# EAGLE design ComponentTester-rev.1 (EAGLE 9.5.1)
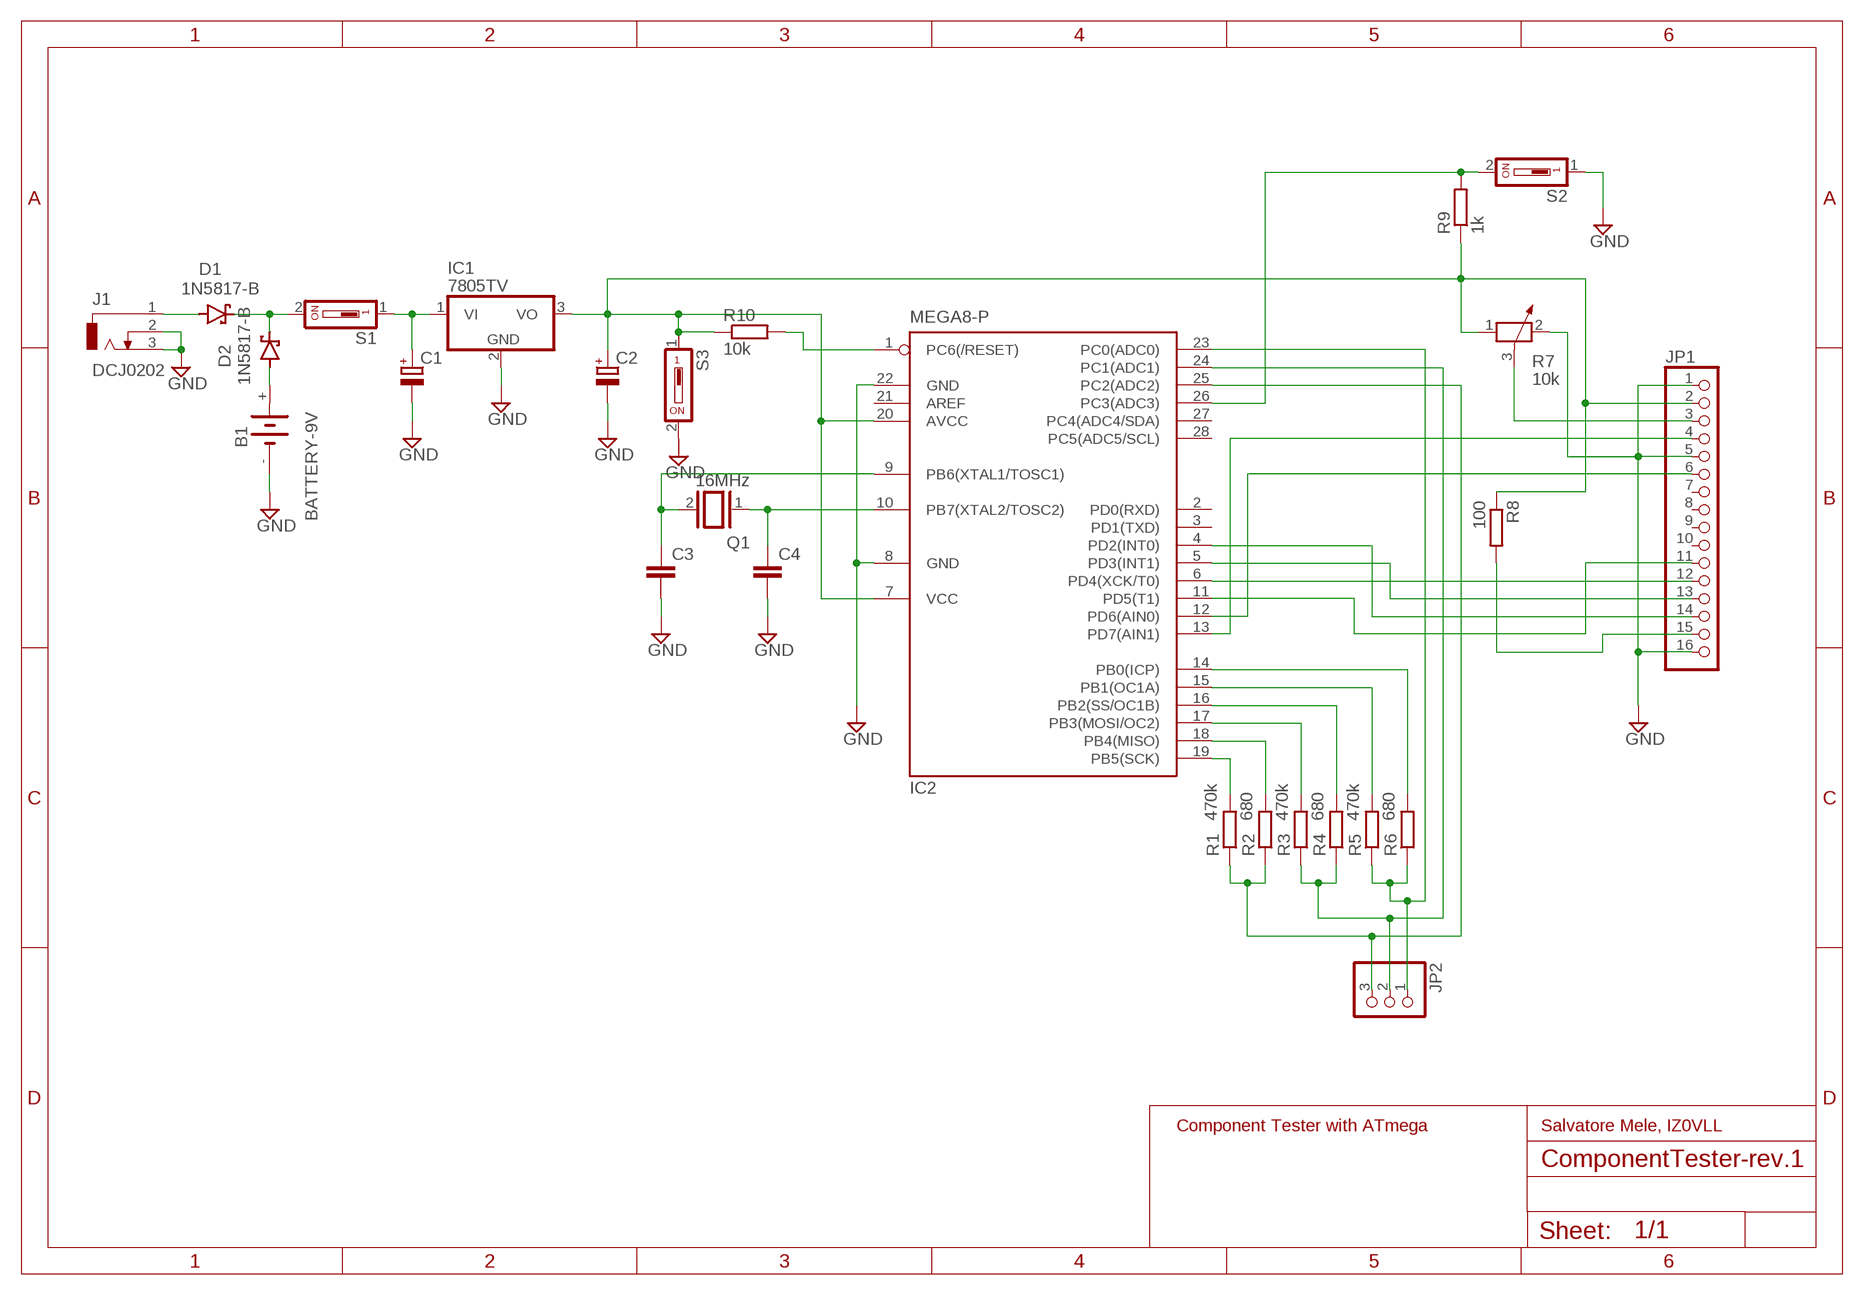
[diagram p0: schematic, sheet 1]

## Parts
B1  BATTERY-9V  [9V-BATTERY-SNAP]
C1  CPOL-EUE2.5-6  [E2,5-6]
C2  CPOL-EUE2.5-6  [E2,5-6]
C3  C-EU025-024X044  [C025-024X044]
C4  C-EU025-024X044  [C025-024X044]
D1  1N5817-B  [DO41-7.6]
D2  1N5817-B  [DO41-7.6]
IC1  7805TV  [TO220V]
IC2  MEGA8-P  [DIL28-3]
J1  DCJ0202  [DCJ0202]
JP1  PINHD-1X16  [1X16]
JP2  PINHD-1X3  [1X03]
Q1  16MHz  XTAL/S  [QS]
R1  470k  R-EU_0207/10  [0207/10]
R2  680  R-EU_0207/10  [0207/10]
R3  470k  R-EU_0207/10  [0207/10]
R4  680  R-EU_0207/10  [0207/10]
R5  470k  R-EU_0207/10  [0207/10]
R6  680  R-EU_0207/10  [0207/10]
R7  10k  POTENTIOMETER_PT-10S  [PT-10S]
R8  100  R-EU_0207/10  [0207/10]
R9  1k  R-EU_0207/10  [0207/10]
R10  10k  R-EU_0207/10  [0207/10]
S1  SD4-01  [SD4-01]
S2  SD4-01  [SD4-01]
S3  SD4-01  [SD4-01]

## Nets
GND: B1.- C1.- C2.- C3.2 C4.2 IC1.2(GND) IC2.8(GND) IC2.22(GND) J1.2 J1.3 JP1.1 JP1.5 JP1.16 R7.2 S2.1 S3.2
N$1: C1.+ IC1.1(VI) S1.1
N$2: C2.+ IC1.3(VO) IC2.7(VCC) IC2.20(AVCC) JP1.2 R7.1 R8.1 R9.1 R10.1 S3.1
N$3: IC2.14(PB0(ICP)) R6.2
N$4: IC2.15(PB1(OC1A)) R5.2
N$5: IC2.16(PB2(SS/OC1B)) R4.2
N$6: IC2.17(PB3(MOSI/OC2)) R3.2
N$7: IC2.18(PB4(MISO)) R2.2
N$8: IC2.19(PB5(SCK)) R1.2
N$9: IC2.25(PC2(ADC2)) JP2.3 R1.1 R2.1
N$10: IC2.24(PC1(ADC1)) JP2.2 R3.1 R4.1
N$11: IC2.23(PC0(ADC0)) JP2.1 R5.1 R6.1
N$12: JP1.3 R7.3
N$13: IC2.26(PC3(ADC3)) R9.2 S2.2
N$14: IC2.13(PD7(AIN1)) JP1.4
N$15: IC2.12(PD6(AIN0)) JP1.6
N$16: IC2.4(PD2(INT0)) JP1.14
N$17: IC2.5(PD3(INT1)) JP1.13
N$18: IC2.6(PD4(XCK/T0)) JP1.12
N$19: IC2.11(PD5(T1)) JP1.11
N$20: JP1.15 R8.2
N$21: C4.1 IC2.10(PB7(XTAL2/TOSC2)) Q1.1
N$22: C3.1 IC2.9(PB6(XTAL1/TOSC1)) Q1.2
N$23: IC2.1(PC6(/RESET)) R10.2
N$24: D1.A J1.1
N$25: B1.+ D2.A
N$26: D1.C D2.C S1.2
Unconnected: IC2.2(PD0(RXD)) IC2.3(PD1(TXD)) IC2.21(AREF) IC2.27(PC4(ADC4/SDA)) IC2.28(PC5(ADC5/SCL)) JP1.7 JP1.8 JP1.9 JP1.10

## Notes on the sheet
- Component Tester with ATmega | Salvatore Mele, IZ0VLL

## Library data of the parts
B1 = Power Jacks:BATTERY-9V: 9V battery
C1 C2 = rcl-smele:CPOL-EU: POLARIZED CAPACITOR, European symbol; SPICEPREFIX: C
C3 C4 = rcl-smele:C-EU: CAPACITOR, European symbol; SPICEPREFIX: C
D1 D2 = diode-IZ0VLL-1:1N581*: 1.0A SCHOTTKY BARRIER RECTIFIER Source: http://www.diodes.com/datasheets/ds23001.pdf
IC1 = linear:78*: Positive VOLTAGE REGULATOR Source: http://cache.national.com/ds/LM/LM78L05.pdf http://www.fairchildsemi.com/ds/LM/LM7805.pdf
IC2 = atmel:MEGA8-P: MICROCONTROLLER 8 Kbytes FLASH, 1 kbytes SRAM, 512 bytes EEPROM, USART, 4-channel 10 bit ADC, 2-channel 8 bit ADC Pin compatible with Atmega48, ATMega88, ATMega168 Source: avr.lbr; OC_FARNELL: unknown; OC_NEWARK: unknown
J1 = con-jack:DCJ0202: DC POWER JACK Source: DCJ0202.pdf; OC_FARNELL: unknown; OC_NEWARK: unknown
JP1 = pinhead:PINHD-1X16: PIN HEADER
JP2 = pinhead:PINHD-1X3: PIN HEADER
Q1 = special:XTAL/S: CRYSTAL
R1-R6 R8-R10 = rcl-smele:R-EU_: RESISTOR, European symbol; SPICEPREFIX: R
R7 = rcl-smele:POTENTIOMETER_: Potentiometer; SPICEMODEL: POT; SPICEPREFIX: X
S1-S3 = switch-dil:SD4-01: DIL/CODE SWITCH; OC_FARNELL: unknown; OC_NEWARK: unknown

## Board
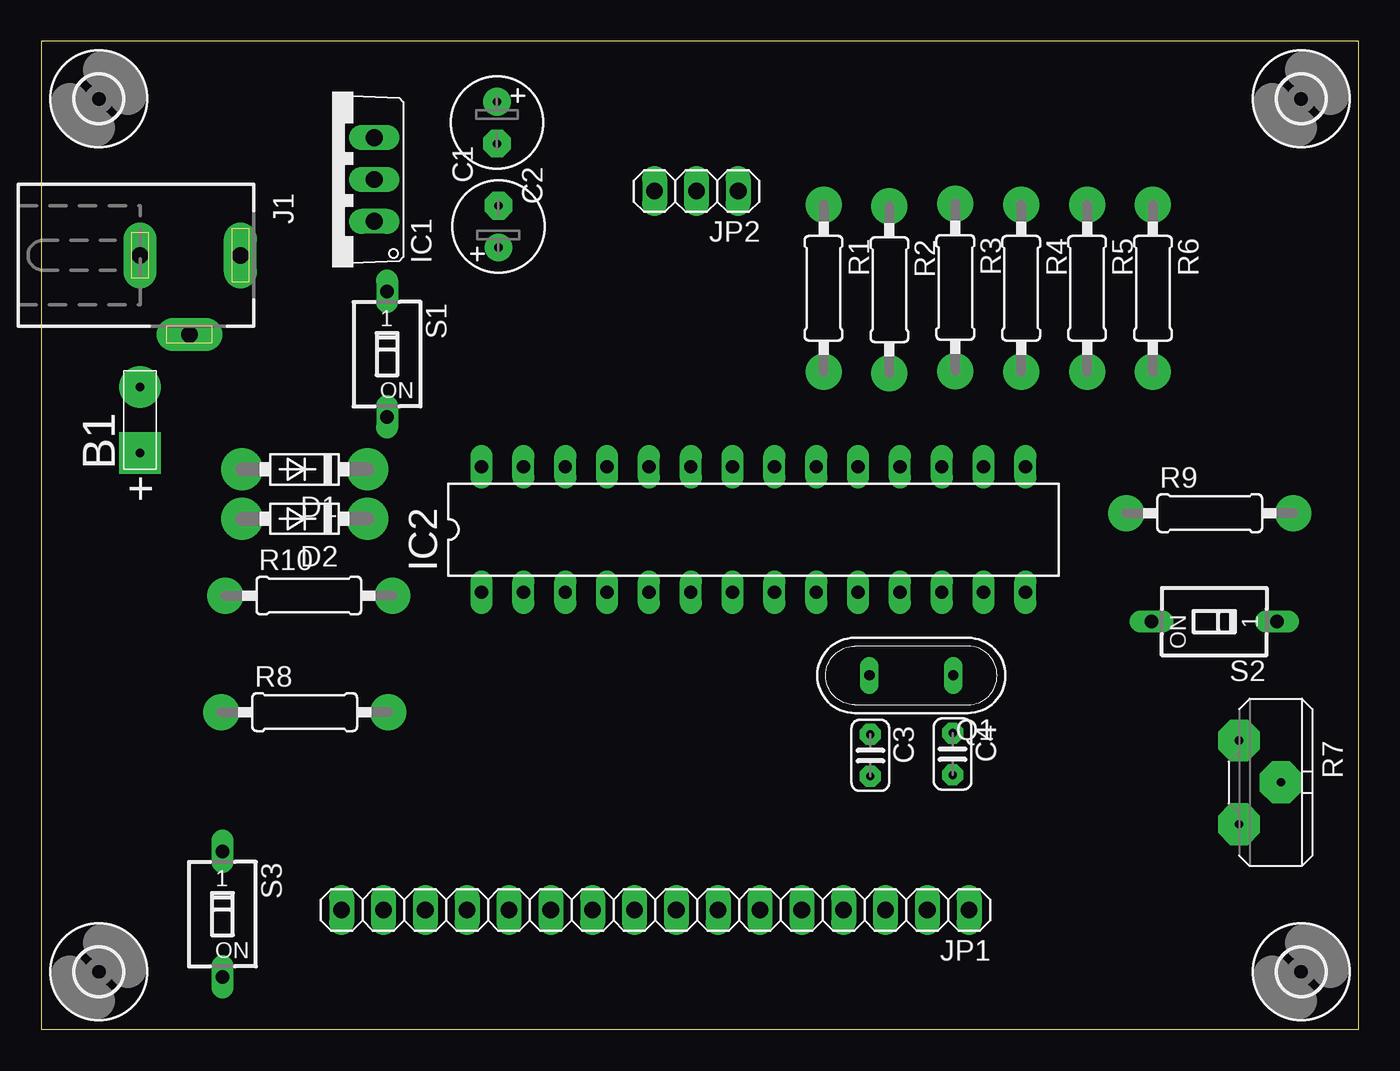
[diagram p1: board, top side]
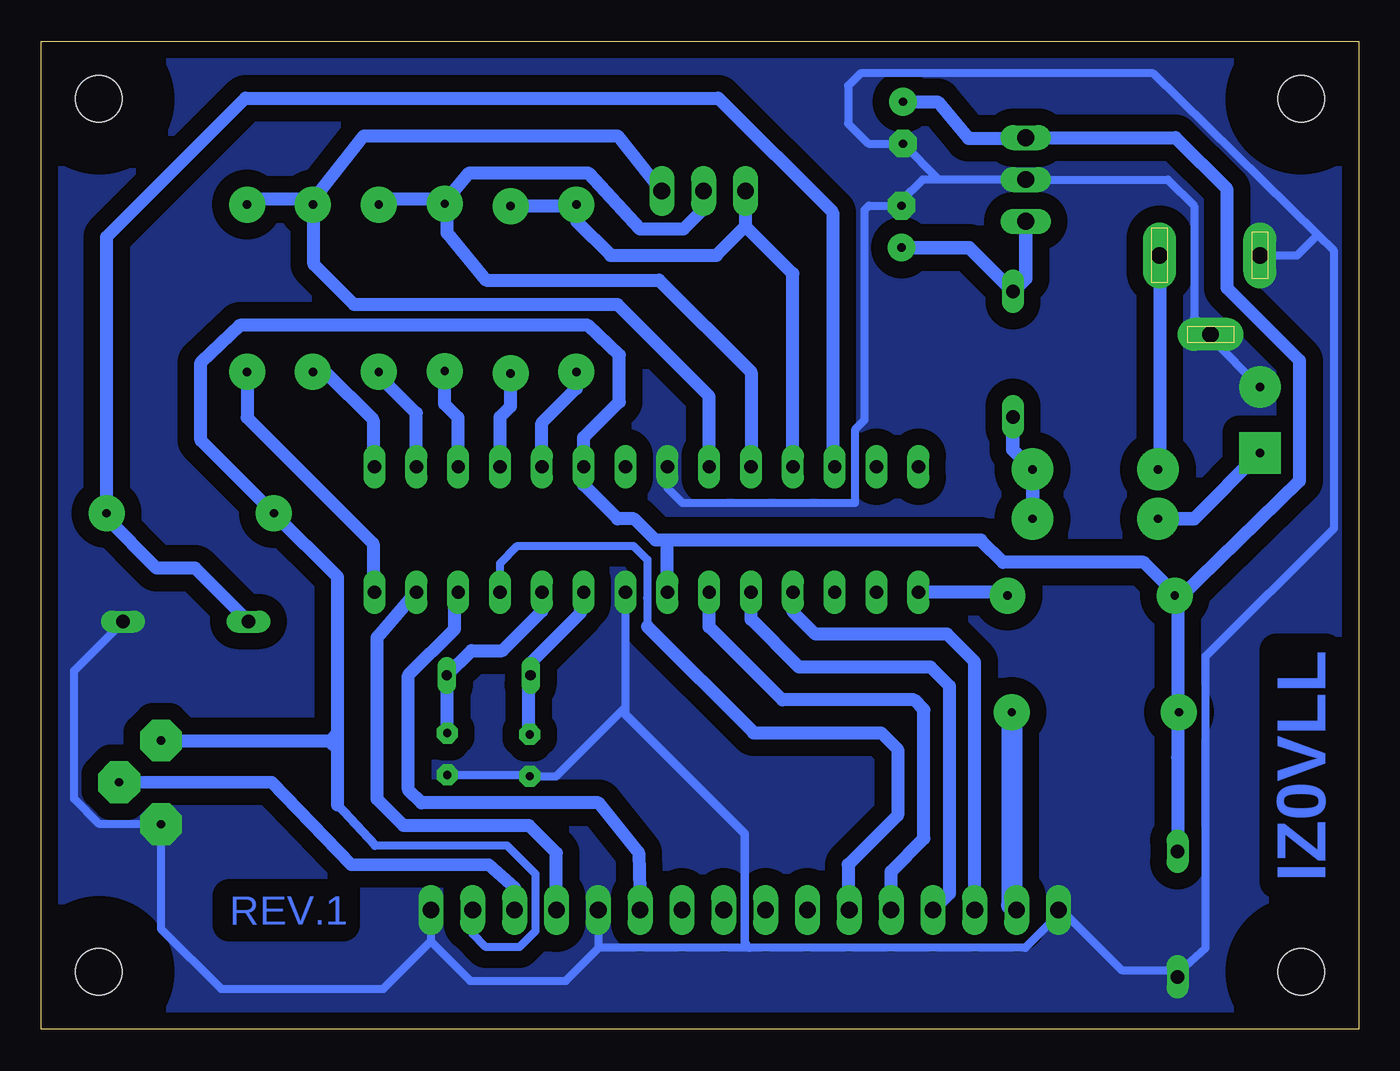
[diagram p2: board, bottom side, seen from below]

Size 80 x 60 mm. Coordinates in mm from the lower left corner, seen from the top.
Outline: 0,0 80,0 80,60 0,60 0,0
Copper layers (1*16): Top 0.035mm / dielectric 1.5mm / Bottom 0.035mm
Design rules "smele *": minimum track width 0.5mm, minimum drill 0.15mm, track to track 0.4mm, track to pad 0.25mm, pad to pad 0.25mm, via to via 0.25mm, smd to smd 6mil, copper to edge 0.5mm, drill to drill 0.25mm, minimum pad ring 10mil, minimum via ring 0.5mm, stop-mask expansion 4mil, vias tented up to drill 0mil, thermal gap 10mil

### Footprints (pad centres in the part's own frame; a part is rotated, then mirrored left to right if it is on the bottom)
9V-BATTERY-SNAP = drill 0.5 pad 2.54 square: + -2,0 | drill 0.5 pad 2.54: - 2,0
E2,5-6 = drill 0.5 pad 1.676: + -1.27,0 | drill 0.5 pad 1.676 octagon: - 1.27,0
C025-024X044 = drill 0.5 pad 1.27 octagon: 1 -1.27,0; 2 1.27,0
DO41-7.6 = drill 0.5 pad 2.54: A 3.81,0; C -3.81,0
TO220V = drill 1.016 long: 1 -2.54,-2.54; 2 0,-2.54; 3 2.54,-2.54
DIL28-3 = drill 0.813 long: 1 -16.51,-3.81; 2 -13.97,-3.81; 3 -11.43,-3.81; 4 -8.89,-3.81; 5 -6.35,-3.81; 6 -3.81,-3.81; 7 -1.27,-3.81; 8 1.27,-3.81; 9 3.81,-3.81; 10 6.35,-3.81; 11 8.89,-3.81; 12 11.43,-3.81; 13 13.97,-3.81; 14 16.51,-3.81; 15 16.51,3.81; 16 13.97,3.81; 17 11.43,3.81; 18 8.89,3.81; 19 6.35,3.81; 20 3.81,3.81; 21 1.27,3.81; 22 -1.27,3.81; 23 -3.81,3.81; 24 -6.35,3.81; 25 -8.89,3.81; 26 -11.43,3.81; 27 -13.97,3.81; 28 -16.51,3.81
DCJ0202 = drill 1 pad 2 long: 1 0,3.1; 2 4.8,0; 3 0,-3
1X16 = drill 1.016 long: 1 -19.05,0; 2 -16.51,0; 3 -13.97,0; 4 -11.43,0; 5 -8.89,0; 6 -6.35,0; 7 -3.81,0; 8 -1.27,0; 9 1.27,0; 10 3.81,0; 11 6.35,0; 12 8.89,0; 13 11.43,0; 14 13.97,0; 15 16.51,0; 16 19.05,0
1X03 = drill 1.016 long: 1 -2.54,0; 2 0,0; 3 2.54,0
QS = drill 0.61 long: 1 -2.54,0; 2 2.54,0
0207/10 = drill 0.5 pad 2.184: 1 -5.08,0; 2 5.08,0
PT-10S = drill 0.5 pad 2.54 octagon: 1 -2.54,-1.27; 2 2.54,-1.27; 3 0,1.27
SD4-01 = drill 0.813 long: 1 0,-3.81; 2 0,3.81
2,8 = hole 2.8: 0,0

### Placement (x,y rotation side)
B1  6,37 90 top
C1  27.76,48.74 90 top
C2  27.67,55.05 270 top
C3  50.34,16.64 270 top
C4  55.34,16.72 270 top
D1  16,34 180 top
D2  16,31 180 top
IC1  17.68,51.6 90 top
IC2  43.25,30.35 0 top
J1  9,47 270 top
JP1  37.29,7.25 180 top
JP2  39.78,50.9 180 top
Q1  52.83,21.49 180 top
R1  47.5,45 270 top
R2  51.5,44.91 270 top
R3  55.5,45.05 270 top
R4  59.5,45 270 top
R5  63.5,45 270 top
R6  67.5,45 270 top
R7  74,15 270 top
R8  16,19.26 0 top
R9  70.95,31.34 0 top
R10  16.25,26.34 0 top
S1  21,41 180 top
S2  71.22,24.76 90 top
S3  11,7 180 top
U$1  [2,8]  3.5,56.5 0 top
U$2  [2,8]  76.5,56.5 0 top
U$3  [2,8]  76.5,3.5 0 top
U$4  [2,8]  3.5,3.5 0 top

### Tracks (layer width: path | path; a pad name or v marks a point on that pad's centre or on a via)
GND
  Bottom 0.5: 46.18,4.92 48.15,2.95 53.95,2.95 56.34,5.34 | JP1.5 46.18,4.92 | 18,7.2 14.4,3.6 11.25,3.6 S3.2 10.8,3.6 9.3,4.95 9.3,22.67 1.5,30.41 1.5,47.27 2.5,48.25 | 37,4.95 20.25,4.95 18,7.2 | 18,7.2 JP1.16 | 2.5,48.25 12.48,58.05 30.25,58.05 31,57.3 31,55 29.78,53.78 C2.- 25.49,51.6 | IC2.8 44.55,26.1 44.55,19.55 48.73,15.37 C3.2 50.42,15.45 C4.2 | S2.1 78,21.79 78,14 76.46,12.46 R7.2 72.73,6.11 69.08,2.46 59.22,2.46 56.34,5.34 | JP1.1 56.34,5.34 | 37.3,5.25 37,4.95 | IC2.22 41.98,32.88 41.05,31.95 30.6,31.95 30.6,36.4 30,37 30,49.75 29.74,50.01 C1.- | 46.18,4.92 46.15,4.95 37,4.95 | 25.49,51.6 IC1.2 11.6,51.6 10,50 10,43.2 J1.2 9,42 B1.- | 25.49,51.6 26.49,51.6 27.76,50.33 C1.- | 27.89,49.88 C1.- | J1.3 3.75,47 2.5,48.25
  Bottom 0.508: 44.55,19.55 44.55,19.15 37.29,11.89 37.29,5.96 37.3,5.96 37.3,5.25
  pour Bottom (isolate 1.016, no thermals): 0,60 80,60 80,0 0,0
N$1
  Bottom 0.813: IC1.1 20.22,45.59 S1.1 23.66,47.47 C1.+
N$2
  Bottom 0.5: 59.72,11.18 51.73,11.18 50,9.45 50,5.96 50.96,5 53,5 53.8,5.8 JP1.2
  Bottom 0.55: 59.72,11.18 62,13.63
  Bottom 0.8: C2.+ 25.57,56.32 23.71,54.1 20.36,54.1 IC1.3 11.14,54.14 8,51 8,45 3.6,40.6 3.6,33.3 11,26.1 | 11,26.1 11,19.05 11,16.51 S3.1 | 11,26.1 R10.1 11.25,26.55 13.05,28.35 21.6,28.35 22.95,29.7 42,29.7 | 62,13.63 62,17 | 62,17 62,18 | 62,18 62,27.47 R9.1 70.3,35.77 70.3,40.5 67.95,42.75 46.8,42.75 44.9,40.95 44.9,38.1 47.06,35.94 IC2.20 47.06,33.06 45,31 44,31 42.7,29.7 42,29.7 | R7.1 62.54,17.54 | IC2.7 42,26.56 42,29.7 | 62.54,17.54 62,17 | 62.54,17.54 62.46,17.54 62,18
  Bottom 1.27: R8.1 10.92,19.13 11,19.05
N$3
  Bottom 0.8: R6.2 67.5,37.15 59.85,29.5 59.85,26.55 IC2.14
N$4
  Bottom 0.8: R5.2 62.77,39.92 59.85,37 59.85,34.2 IC2.15
N$5
  Bottom 0.8: R4.2 59.4,39.6 57.22,37.42 IC2.16
N$6
  Bottom 0.8: IC2.17 54.68,37.15 55.5,37.97 R3.2
N$7
  Bottom 0.8: IC2.18 52.14,37.19 51.5,37.83 R2.2
N$8
  Bottom 0.8: IC2.19 49.6,36.82 47.5,38.92 R1.2
N$9
  Bottom 0.8: JP2.3 37.24,48.76 | 37.24,48.76 39,47 45.42,47 47.5,49.08 R1.1 47.59,49.99 R2.1 | IC2.25 34.36,45.88 37.24,48.76
N$10
  Bottom 0.8: R3.1 55.35,49.95 55.35,48.35 53,45.5 42.5,45.5 36.9,39.9 IC2.24 | R3.1 55.35,50.4 54,52 46.8,52 43.65,48.6 41,48.6 39.78,49.82 JP2.2 | R4.1 59.4,50.4 55.8,50.4 R3.1
N$11
  Bottom 0.8: R5.1 63.45,49.95 63.45,46.45 61,44 45,44 39.44,38.44 IC2.23 | JP2.1 45,54.25 60.41,54.25 63.45,50.4 R5.1 | R6.1 67.5,50.4 63.9,50.4 R5.1
N$12
  Bottom 0.75: R7.3 66,15 61.17,10 52.83,10 51.26,8.61 JP1.3
N$13
  Bottom 0.8: IC2.26 31.95,34.2 31.95,49.6 38.9,56.55 67.6,56.55 76.03,48.12 R9.2 76.03,31.03 73,28 70.65,28 S2.2
N$14
  Bottom 0.8: IC2.13 59.6,23.78 59.6,13.97 58,12.38 50.38,12.38 48.72,10.72 JP1.4
N$15
  Bottom 0.8: IC2.12 54.9,26.1 54.9,24.3 57.7,21.5 57.7,14.55 56.9,13.75 46.15,13.75 43.73,10.73 JP1.6
N$16
  Bottom 0.8: JP1.14 23.32,22.32 25,24 33,24 34.36,25.36 IC2.4
N$17
  Bottom 0.8: JP1.13 24.86,8.25 24.86,20.86 26,22 34,22 36.9,24.9 IC2.5
N$18
  Bottom 0.8: IC2.6 39.44,24.44 35,20 27,20 26.4,19.4 26.4,11.6 28.4,9.6 JP1.12
N$19
  Bottom 0.5: IC2.11 52.14,28.3 51.08,29.36 44.04,29.36 43.2,28.52 43.2,26.56 43.21,26.21 43.2,26.19 43.2,24.46 | 31,7.31 JP1.11
  Bottom 0.8: 43.2,24.46 36.74,18 29,18 28,17 28,13 31,10 31,7.31
N$20
  Bottom 1.27: R8.2 21.08,7.55 JP1.15
N$21
  Bottom 0.8: 55.35,20.7 55.35,18.1 C4.1 | 55.35,20.7 55.35,21.15 Q1.1 | 55.35,20.7 Q1.1 | IC2.10 49.6,25.4 52,23 53.86,23 Q1.1
N$22
  Bottom 0.8: C3.1 50.4,18.1 50.4,21.15 Q1.2 50.29,22.26 47.25,25.3 47.25,26.1 IC2.9
N$23
  Bottom 0.5: 26.55,26.55 IC2.1 | 21.6,26.55 R10.2
  Bottom 0.8: 21.6,26.55 26.55,26.55
N$24
  Bottom 0.8: J1.1 12.1,35.18 D1.A
N$25
  Bottom 0.813: B1.+ 10,31 D2.A
N$26
  Bottom 0.813: S1.2 21,35.19 D1.C D2.C

### Text on the board
Bottom: IZ0VLL | REV.1